# EasyEDA Pro project Ease buck regulator v2.eprj

# Schematic Schematic1
Board Name: Board1; Create Date: 2025-06-07; Page Name: P1; Project Name: Ease buck regulator v2; Schematic Name: Schematic1; Update Date: 2025-06-10; Company: EasyEDA.com; Page Size: A4; Version: V1.0
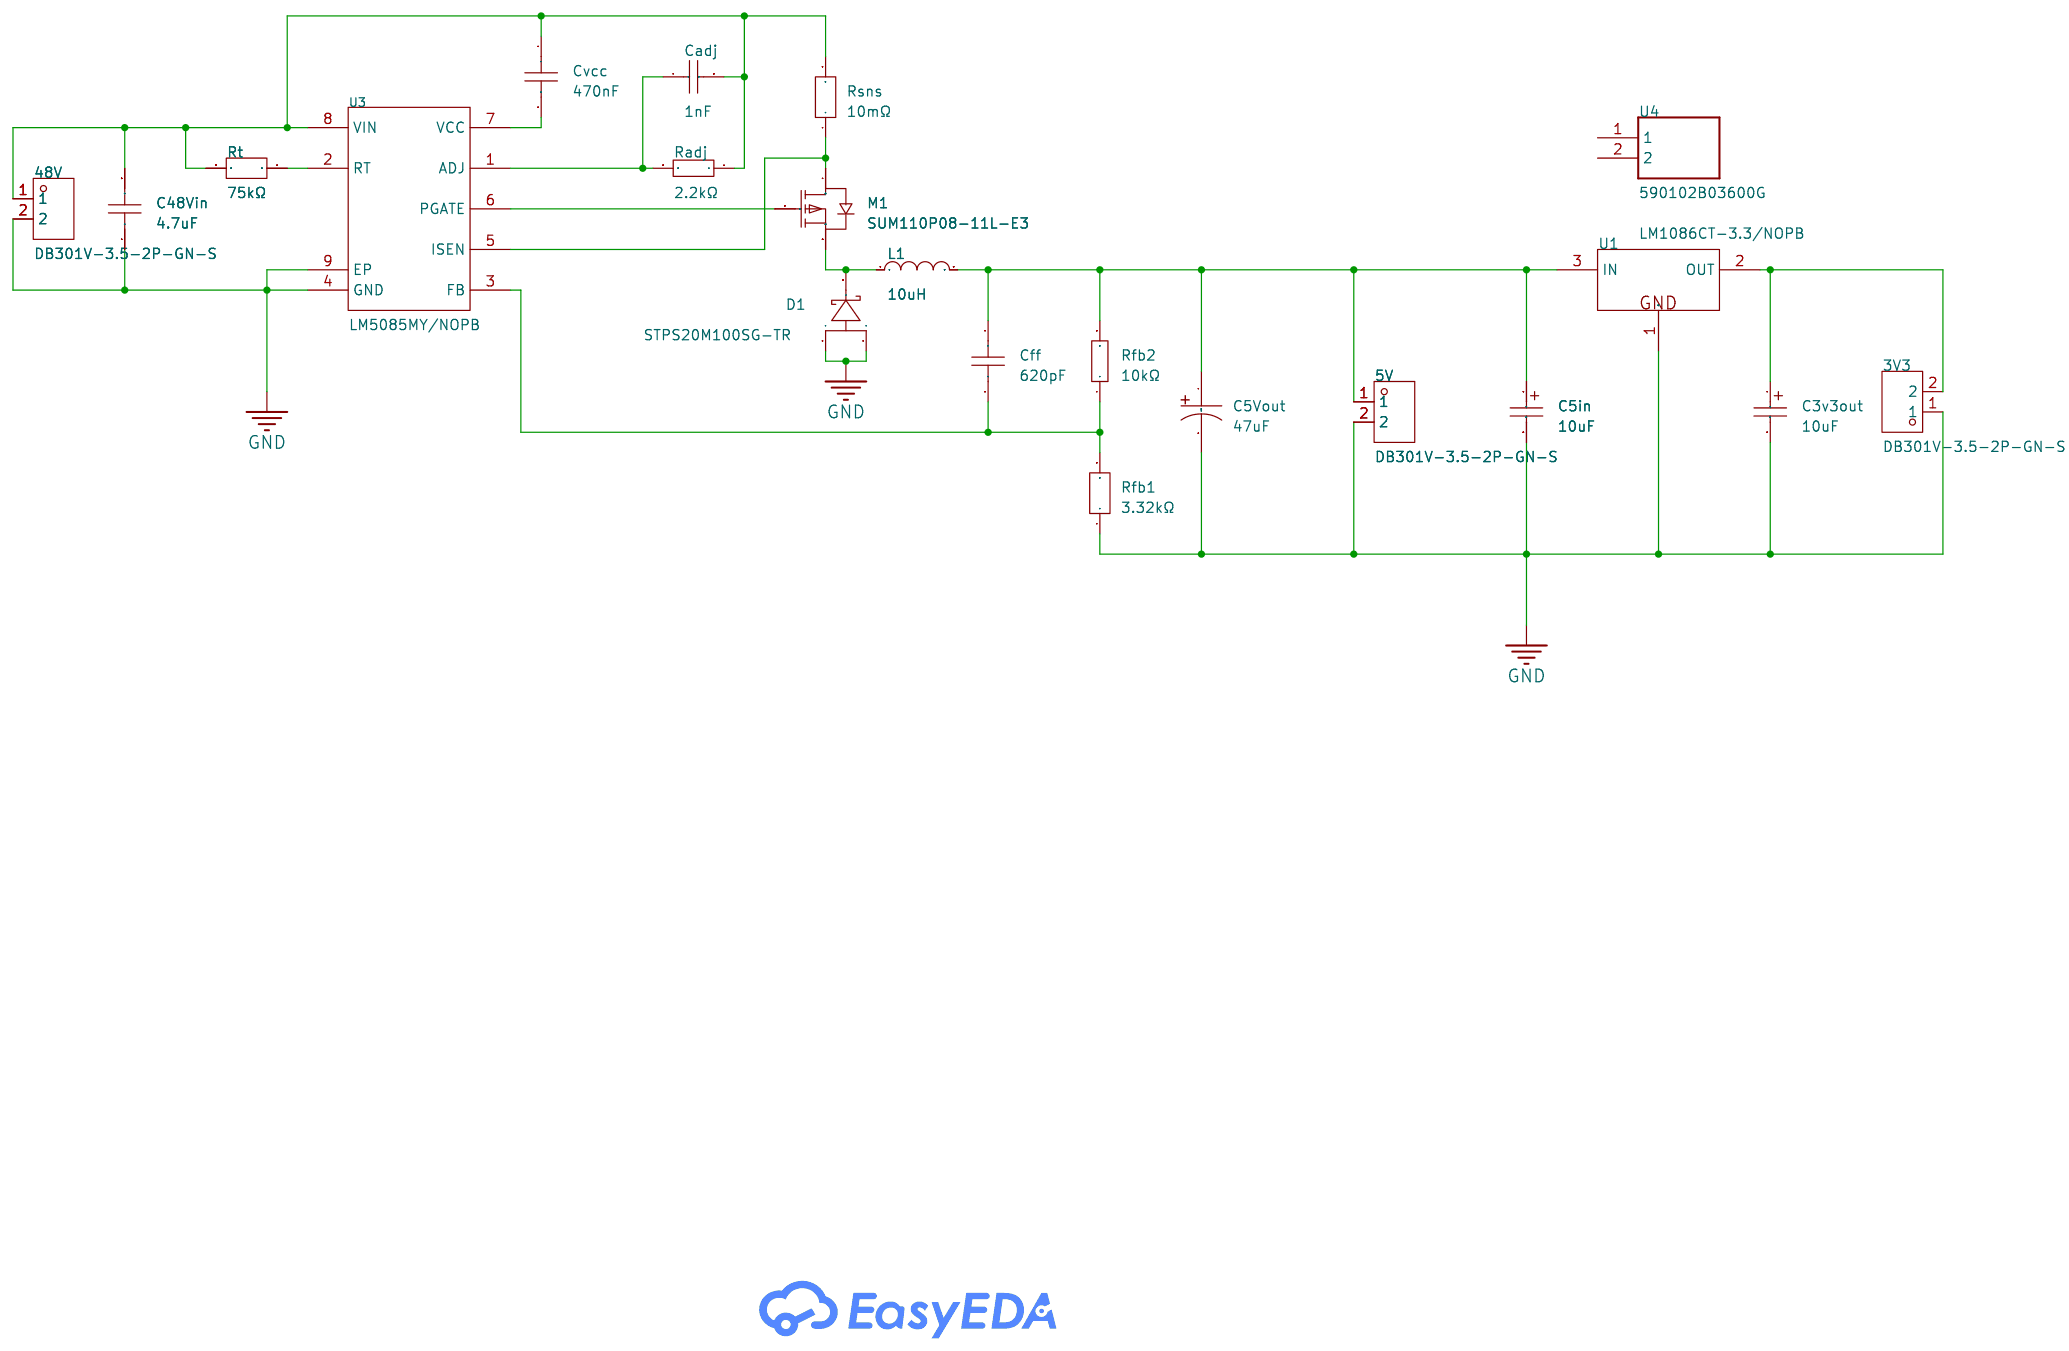
[diagram p0: schematic sheet]

## Parts
3V3  DB301V-3.5-2P-GN-S  [CONN-TH_DB301V-3.5-2P-GN]
5V  DB301V-3.5-2P-GN-S  [CONN-TH_DB301V-3.5-2P-GN]
48V  DB301V-3.5-2P-GN-S  [CONN-TH_DB301V-3.5-2P-GN]
C3v3out  10uF  [CASE-A_3216]
C5in  10uF  [CASE-A_3216]
C5Vout  47uF  [CAP-SMD_L3.5-W2.8]
C48Vin  4.7uF  [C1210]
Cadj  1nF  [C0805]
Cff  620pF  [C0805]
Cvcc  470nF  [C0805]
D1  STPS20M100SG-TR  [D2PAK_L10.4-W8.5-P2.54-LS15.4-BR]
L1  10uH  [IND-SMD_L13.9-W13.5]
M1  SUM110P08-11L-E3  [TO-263-2_L10.0-W9.1-P5.08-LS15.2-BL-2]
Radj  2.2kΩ  [R0603]
Rfb1  3.32kΩ  [R0402]
Rfb2  10kΩ  [R0402]
Rsns  10mΩ  [R1206]
Rt  75kΩ  [R0402]
U1  LM1086CT-3.3/NOPB  [TO-220-3_L10.0-W4.5-P2.54-L]
U3  LM5085MY/NOPB  [MSOP-8_L3.0-W3.0-P0.65-LS5.0-BL-EP]
U4  590102B03600G  [added line]

## Library data of the parts
3V3 5V 48V = DB301V-3.5-2P-GN-S: LCSC Part Name: 1x2P 3.5mm 直插 排数:1 每排P数:2; Supplier Part: C695629; Manufacturer: DORABO(地博电气); Supplier Footprint: 插件,P=3.5mm; JLCPCB Part Class: Extended Part; Datasheet: https://atta.szlcsc.com/upload/public/pdf/source/20230106/1B95616A85A883CA085E21635C8A8490.pdf; Supplier: LCSC; Number of Positions or Pins: 1x2P; Pitch: 3.5mm; Color: Green; Mounting Type: Direct Insert; Number of Pins: 2P; Number of Rows: 1; Number of PINs Per Row: 2; Screw Specification: M2; Current Rating: 7A; Voltage Rating (Max): 300V; Operating Temperature: -40℃~+105℃
C3v3out C5in = TAJA106M010RNJ: LCSC Part Name: 10uF ±20% 10V; Supplier Part: C92127; Manufacturer: Kyocera AVX; Supplier Footprint: CASE-A-3216; JLCPCB Part Class: Extended Part; Datasheet: https://atta.szlcsc.com/upload/public/pdf/source/20170322/1490151677352.pdf; Supplier: LCSC; Tolerance: ±20%; Equivalent Series Resistance(ESR): 3Ω@100kHz; Operating Temperature: -55℃~+125℃
C5Vout = TPSB476K010R0250: LCSC Part Name: 47uF ±10% 10V; Supplier Part: C308881; Manufacturer: Kyocera AVX; Supplier Footprint: CASE-B-3528; JLCPCB Part Class: Extended Part; Datasheet: https://atta.szlcsc.com/upload/public/pdf/source/20190621/C308909_9D37C5E2EC8949438110162F4533A132.pdf; Supplier: LCSC; Tolerance: ±10%; Equivalent Series Resistance(ESR): 250mΩ@100kHz; Operating Temperature: -55℃~+125℃
C48Vin = GCM32DC72A475KE02L: LCSC Part Name: 4.7uF ±10% 100V; Supplier Part: C913445; Manufacturer: muRata(村田); Supplier Footprint: 1210; JLCPCB Part Class: Extended Part; Datasheet: https://atta.szlcsc.com/upload/public/pdf/source/20201110/C913436_BC89257AF1CC170DEC759F9C1F15D7BC.pdf; Supplier: LCSC; Tolerance: ±10%; Voltage Rating: 100V; Temperature Coefficient: X7S
Cadj = CL21C102JBCNNNC: LCSC Part Name: 1nF ±5% 50V; Supplier Part: C1791; Manufacturer: SAMSUNG(三星); Supplier Footprint: 0805; JLCPCB Part Class: Extended Part; Datasheet: https://atta.szlcsc.com/upload/public/pdf/source/20160218/1457707763339.pdf; Supplier: LCSC; Tolerance: ±5%; Voltage Rating: 50V; Temperature Coefficient: C0G
Cff = CL21C621JBCNNNC: LCSC Part Name: 620pF ±5% 50V; Supplier Part: C307556; Manufacturer: SAMSUNG(三星); Supplier Footprint: 0805; JLCPCB Part Class: Extended Part; Datasheet: https://atta.szlcsc.com/upload/public/pdf/source/20160218/1457707763339.pdf; Supplier: LCSC; Tolerance: ±5%
Cvcc = TMK212BJ474KD-T: LCSC Part Name: MSAST219SB5474KTNA01 470nF ±10% 25V; Supplier Part: C386088; Manufacturer: TAIYO YUDEN(太诱); Supplier Footprint: 0805; JLCPCB Part Class: Extended Part; Datasheet: https://atta.szlcsc.com/upload/public/pdf/source/20210525/C2802164_C0429B055888A674C3F00BA74B841C5B.pdf; Supplier: LCSC; Tolerance: ±10%
D1 = STPS20M100SG-TR: LCSC Part Name: 电压:100V 电流:20A; Supplier Part: C969989; Manufacturer: ST(意法半导体); Supplier Footprint: D2PAK; JLCPCB Part Class: Extended Part; Datasheet: https://atta.szlcsc.com/upload/public/pdf/source/20201210/C969989_D9B9A94A3428CBD50DBC84FA20B76C6C.pdf; Supplier: LCSC; Diode Configuration: Independent Type; Forward Voltage (Vf@If): 775mV@20A; Reverse Voltage (Vr): 100V; Rectified Current: 20A; Reverse Leakage Current (Ir): 10uA@100V
L1 = SRP1250-100M: LCSC Part Name: 10uH ±20% 16A; Supplier Part: C2045749; Manufacturer: BOURNS; Supplier Footprint: SMD,13.5x13.9mm; JLCPCB Part Class: Extended Part; Datasheet: https://atta.szlcsc.com/upload/public/pdf/source/20210630/4DDA93E166372CA8826EA735E154300C.pdf; Supplier: LCSC; Tolerance: ±20%; Saturation Current (Isat): 16A
M1 = SUM110P08-11L-E3: LCSC Part Name: 1个P沟道 耐压:80V 电流:23.5A; Supplier Part: C2838509; Manufacturer: VISHAY(威世); Supplier Footprint: TO-263-2; JLCPCB Part Class: Extended Part; Datasheet: https://atta.szlcsc.com/upload/public/pdf/source/20210629/C2838509_ABAE0D27A8815A2567646410D30D40FD.pdf; Supplier: LCSC; Type: 1 Piece P-Channel; Drain Source On Resistance (RDS(on)@Vgs,Id): 0.0112Ω@10V,20A; Total Gate Charge (Qg@Vgs): 85nC@10V; Input Capacitance (Ciss@Vds): 10.85nF@40V; Reverse Transfer Capacitance (Crss@Vds): 700pF@40V; Operating Temperature: -55℃~+175℃
Radj = RC0603FR-072K2L: LCSC Part Name: 厚膜电阻 2.2kΩ ±1% 100mW; Supplier Part: C114662; Manufacturer: YAGEO(国巨); Supplier Footprint: 0603; JLCPCB Part Class: Extended Part; Datasheet: https://atta.szlcsc.com/upload/public/pdf/source/20170914/C127450_1505359406912967677.pdf; Supplier: LCSC; Type: Thick Film Resistors; Tolerance: ±1%; Power(Watts): 100mW; Voltage-Supply(Max): 75V; Temperature Coefficient: ±100ppm/℃; Operating Temperature: -55℃~+155℃
Rfb1 = CRCW04023K32FKED: LCSC Part Name: 厚膜电阻 3.32kΩ ±1% 62.5mW; Supplier Part: C4190093; Manufacturer: VISHAY(威世); Supplier Footprint: 0402; JLCPCB Part Class: Extended Part; Datasheet: https://atta.szlcsc.com/upload/public/pdf/source/20231211/912936F7C39622EC4E701DC64839DA0A.pdf; Supplier: LCSC; Type: Thick Film Resistors; Tolerance: ±1%; Power(Watts): 62.5mW; Temperature Coefficient: ±100ppm/℃; Operating Temperature: -55℃~+155℃
Rfb2 = CRCW040210K0FKED: LCSC Part Name: 厚膜电阻 10kΩ ±1% 63mW; Supplier Part: C71617; Manufacturer: VISHAY(威世); Supplier Footprint: 0402; JLCPCB Part Class: Extended Part; Datasheet: https://atta.szlcsc.com/upload/public/pdf/source/20180420/C190124_A776A444B598E5893D919B5902899056.pdf; Supplier: LCSC; Type: Thick Film Resistors; Tolerance: ±1%; Power(Watts): 63mW; Voltage-Supply(Max): 50V; Temperature Coefficient: ±100ppm/℃; Operating Temperature: -55℃~+155℃
Rsns = WSLP1206R0100FEA: LCSC Part Name: 10mΩ ±1% 1W; Supplier Part: C844910; Manufacturer: VISHAY(威世); Supplier Footprint: 1206; JLCPCB Part Class: Extended Part; Datasheet: https://atta.szlcsc.com/upload/public/pdf/source/20211116/D765CD6DEE6B58580DC3D6FFBE8A7951.pdf; Supplier: LCSC; Tolerance: ±1%; Power(Watts): 1W; Temperature Coefficient: ±75ppm/℃; Operating Temperature: -65℃~+170℃
Rt = CRCW040275K0FKED: LCSC Part Name: 厚膜电阻 75kΩ ±1% 63mW; Supplier Part: C482234; Manufacturer: VISHAY(威世); Supplier Footprint: 0402; JLCPCB Part Class: Extended Part; Datasheet: https://atta.szlcsc.com/upload/public/pdf/source/20200618/C481956_E25174B008CE8C884BEDD7D4D15E674F.pdf; Supplier: LCSC; Type: Thick Film Resistors; Tolerance: ±1%; Power(Watts): 63mW; Voltage-Supply(Max): 75V; Temperature Coefficient: ±100ppm/℃; Operating Temperature: -55℃~+155℃
U1 = LM1086CT-3.3/NOPB: LCSC Part Name: 1.5A、29V 线性稳压器; Supplier Part: C2877404; Manufacturer: TI(德州仪器); Supplier Footprint: TO-220; JLCPCB Part Class: Extended Part; Datasheet: https://www.ti.com/cn/lit/gpn/lm1086; Supplier: LCSC; Output Type: Fixed; Voltage - Supply: 27V; Output Voltage: 3.3V; Output Current: 1.5A; Power Supply Rejection Ratio (PSRR): 72dB@(120Hz); Voltage Dropout: 1.5V@(1.5A); standby current: 5mA; Features: Overcurrent Protection(OCP); Operating Temperature: 0℃~+125℃; Output Configuration: Positive electrode; Number of Outputs: 1
U3 = LM5085MY/NOPB: Supplier Part: C79823; Manufacturer: TI(德州仪器); Supplier Footprint: MSOP-8-EP; JLCPCB Part Class: Extended Part; Datasheet: https://www.ti.com/cn/lit/gpn/lm5085; Supplier: LCSC; Function: Step-down type; Input Voltage: 4.5V~75V; Switching Frequency: 1MHz; Operating Temperature: -40℃~+125℃@(TJ); Synchronous Rectification: NO; Number of Outputs: 1; Topology: Step-down; Switch tube (built-in/external): 外置
U4 = 590102B03600G: heatsink 10 C W

## Nets
GND: 3V3.1 5V.2 48V.2 C3v3out.2 C5in.2 C5Vout.2 C48Vin.1 D1.1(A) D1.2(A) Rfb1.1 U1.1(GND) U3.4(GND) U3.9(EP)
$1N4213: 48V.1 C48Vin.2 Cadj.2 Cvcc.1 Radj.1 Rsns.2 Rt.2 U3.8(VIN)
$1N4243: Rt.1 U3.2(RT)
$1N4505: Cvcc.2 U3.7(VCC)
$1N4530: Cadj.1 Radj.2 U3.1(ADJ)
$1N4608: M1.4(D) Rsns.1 U3.5(ISEN)
$1N4627: M1.1(G) U3.6(PGATE)
$1N4634: D1.3(K) L1.1 M1.3(S)
$1N4655: 5V.1 C5in.1 C5Vout.1 Cff.1 L1.2 Rfb2.2 U1.3(IN)
$1N4682: Cff.2 Rfb1.2 Rfb2.1 U3.3(FB)
$1N5055: 3V3.2 C3v3out.1 U1.2(OUT)

Not connected (* = marked no-connect by the designer): U4 1 2

# Board PCB1
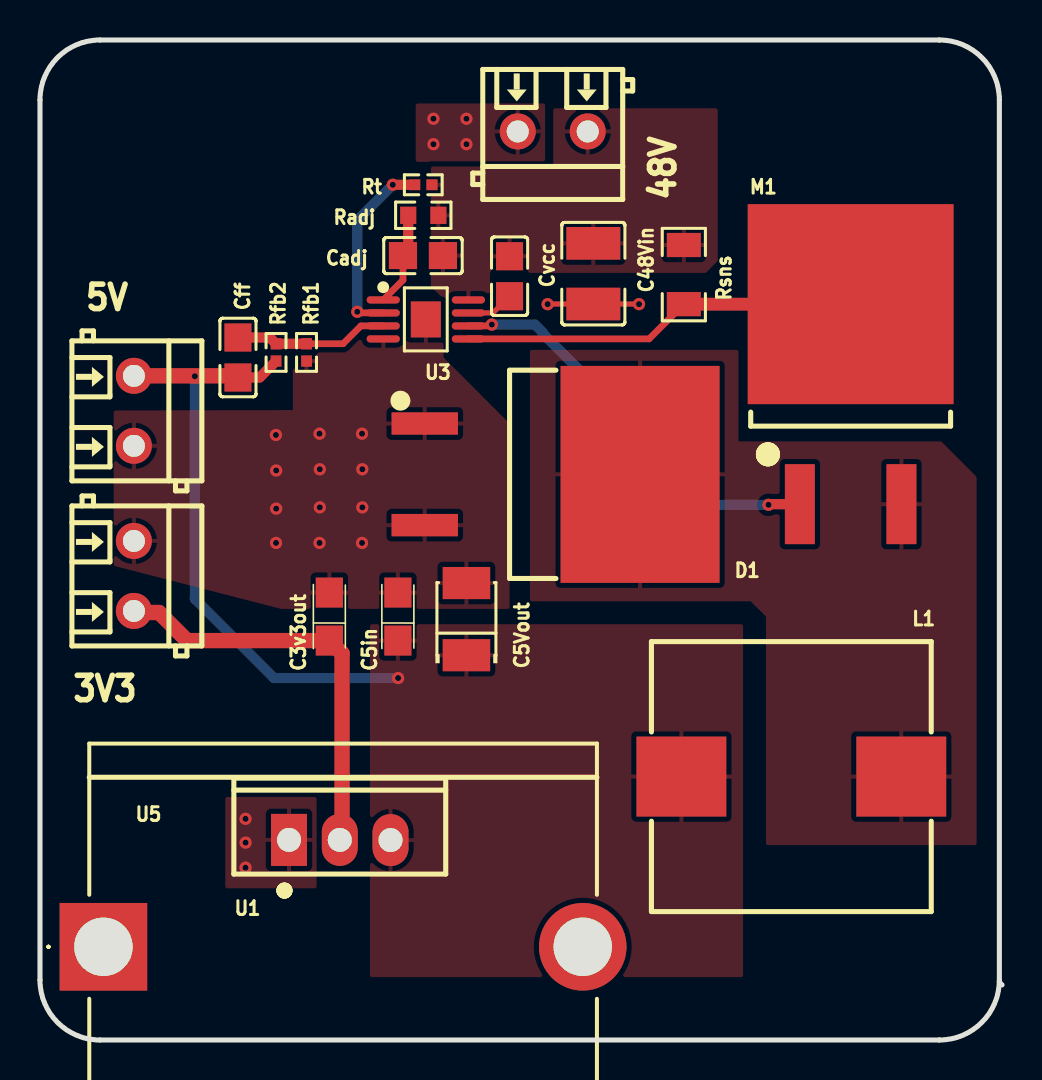
[diagram p1: board, top side]
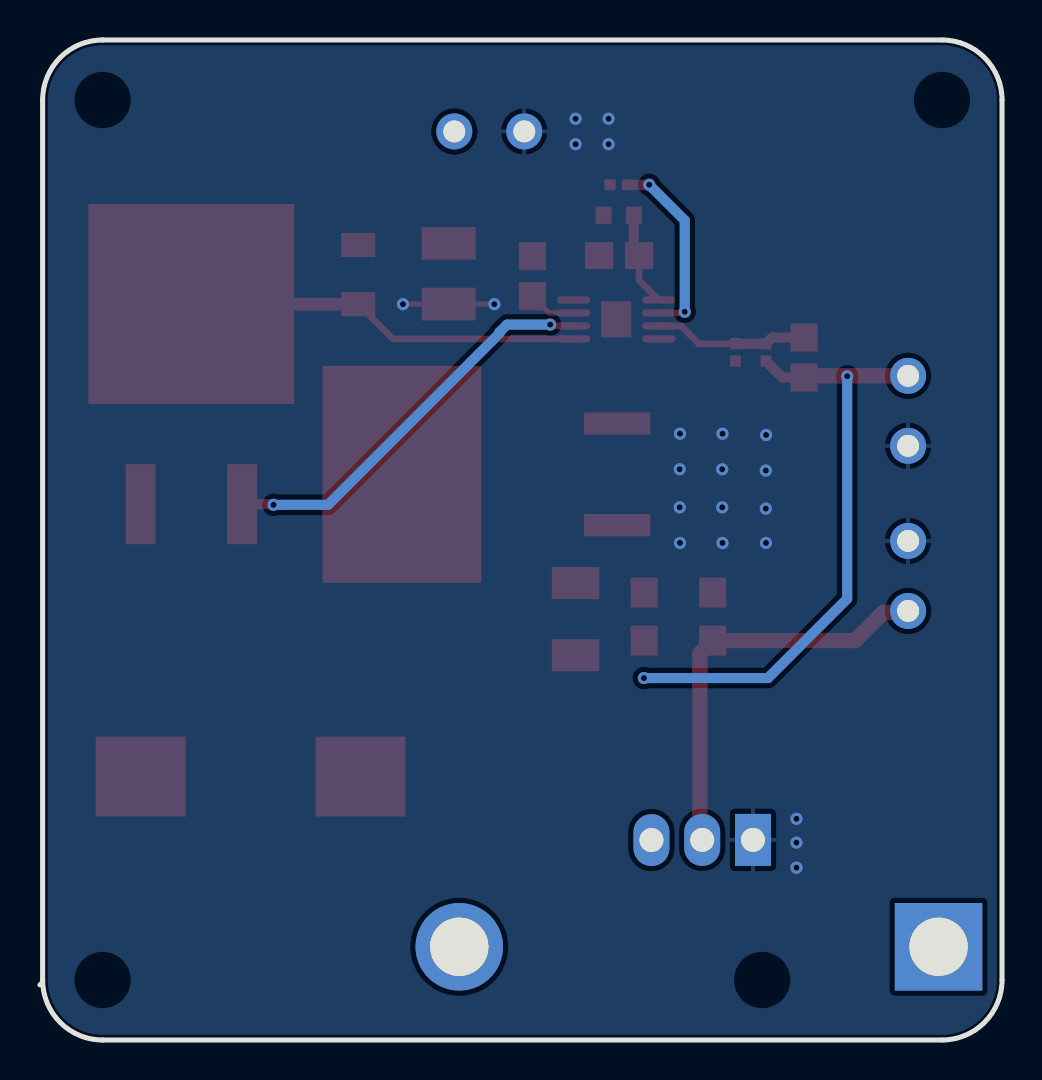
[diagram p2: board, bottom side, seen from below]

Outline 48.13 x 50 mm; copper layers: Top Layer, Bottom Layer. Coordinates in mm from the lower left corner of the outline.
Outline path: 48,3 arc(47.12,0.88) 45,0 3,0 arc(0.88,0.88) 0,3 0,47 arc(0.88,49.12) 3,50 45,50 arc(47.12,49.12) 48,47 48,2.89 48.13,2.76
Stack: Top Layer 0.035mm / Dielectric1 1.51mm FR4 er 4.5 / Bottom Layer 0.035mm

## Design rules (mm)
template: Custom Config
spacing copperThickness1oz (default): track to track 0.152, other pairs 0.152 to 0.3
spacing copperThickness2oz: track to track 0.203, other pairs 0.152 to 0.3
track width copperThickness1oz (default): min 0.127, default 0.254, max 2.54
track width copperThickness2oz: min 0.203, default 0.254, max 2.54
differential pair differentialPair (default): width min 0.127, default 0.254, max 2.54; gap min 0.152, default 0.152
via viaSize (default): diameter min 0.5, default 0.61, max 10; hole min 0.3, default 0.305, max 6.3

## Placement (name value [footprint] x y rotation side)
3V3  DB301V-3.5-2P-GN-S  [CONN-TH_DB301V-3.5-2P-GN]  4.7 23.2 270 top
5V  DB301V-3.5-2P-GN-S  [CONN-TH_DB301V-3.5-2P-GN]  4.7 31.46 270 top
48V  DB301V-3.5-2P-GN-S  [CONN-TH_DB301V-3.5-2P-GN]  25.65 45.43 180 top
C3v3out  10uF  [CASE-A_3216]  14.48 21.17 90 top
C5in  10uF  [CASE-A_3216]  17.91 21.17 90 top
C5Vout  47uF  [CAP-SMD_L3.5-W2.8]  21.34 21.04 270 top
C48Vin  4.7uF  [C1210]  27.69 38.32 90 top
Cadj  1nF  [C0805]  19.16 39.22 0 top
Cff  620pF  [C0805]  9.91 34.12 90 top
Cvcc  470nF  [C0805]  23.5 38.19 270 top
D1  STPS20M100SG-TR  [D2PAK_L10.4-W8.5-P2.54-LS15.4-BR]  24.64 28.28 0 top
L1  10uH  [IND-SMD_L13.9-W13.5]  37.59 13.17 180 top
M1  SUM110P08-11L-E3  [TO-263-2_L10.0-W9.1-P5.08-LS15.2-BL-2]  40.56 31.79 0 top
Radj  2.2kΩ  [R0603]  19.18 41.24 180 top
Rfb1  3.32kΩ  [R0402]  13.34 34.38 90 top
Rfb2  10kΩ  [R0402]  11.81 34.38 270 top
Rsns  10mΩ  [R1206]  32.21 38.27 90 top
Rt  75kΩ  [R0402]  19.18 42.76 0 top
U1  LM1086CT-3.3/NOPB  [TO-220-3_L10.0-W4.5-P2.54-L]  15 10 0 top
U3  LM5085MY/NOPB  [MSOP-8_L3.0-W3.0-P0.65-LS5.0-BL-EP]  19.3 36.03 270 top
U5  590102B03600G  [added line]  15.11 15.84 0 top

## Footprints (pads in the part's own frame, mm; a bottom-side part is the same pattern mirrored in y, then rotated)
added line
  rect 4.38x4.38 hole 2.92: 1(-11.938,-11.176)
  round 4.38 hole 2.92: 2(12.042,-11.176)
C0805
  rect 1.41x1.35 smd: 1(-1,0) 2(1,0)
C1210
  rect 1.635x2.7 smd: 1(-1.518,0) 2(1.518,0)
CAP-SMD_L3.5-W2.8
  rect 1.607x2.376 smd: 1(1.804,0) 2(-1.804,0)
CASE-A_3216
  rect 1.5x1.359 smd: 1(-1.2,0) 2(1.2,0)
CONN-TH_DB301V-3.5-2P-GN
  round 1.8 hole 1.1: 1(-1.75,0) 2(1.75,0)
D2PAK_L10.4-W8.5-P2.54-LS15.4-BR
  rect 3.318x1.12 smd: 1(-5.386,2.54) 2(-5.386,-2.54)
  rect 7.954x10.842 smd: 3(5.386,0)
IND-SMD_L13.9-W13.5
  rect 4.5x4 smd: 1(-5.5,0) 2(5.5,0)
MSOP-8_L3.0-W3.0-P0.65-LS5.0-BL-EP
  oval 0.364x1.662 smd: 1(-0.975,-2.131) 2(-0.325,-2.131) 3(0.325,-2.131) 4(0.975,-2.131) 5(0.975,2.131) 6(0.325,2.131) 7(-0.325,2.131) 8(-0.975,2.131)
  rect 1.8x1.5 smd: 9(0,0)
R0402
  rect 0.566x0.54 smd: 1(-0.433,0) 2(0.433,0)
R0603
  rect 0.806x0.864 smd: 1(-0.753,0) 2(0.753,0)
R1206
  rect 1.208x1.701 smd: 1(-1.479,0) 2(1.479,0)
TO-220-3_L10.0-W4.5-P2.54-L
  rect 1.8x2.6 hole 1.2: 1(-2.54,0.005)
  oval 1.8x2.6 hole 1.2: 2(0,0.005) 3(2.54,-0.005)
TO-263-2_L10.0-W9.1-P5.08-LS15.2-BL-2
  rect 1.5x4 smd: 1(-2.54,-5) 3(2.54,-5)
  rect 10.3x10 smd: 4(0.001,5)

## Nets
As in the schematic.

Pads without a net: U5 1 2

## Via types
v1: diameter 0.61, hole 0.305, Top Layer to Bottom Layer, 27 vias

## Routing (per net, layer and track width the routed paths; a pad name or vN(x,y) marks a point on that pad's centre or on a via; arc(x,y) is an arc through that point)
GND: length 4.6
  Top Layer w0.254: v1(25.4,36.79) 25.41,36.8 C48Vin.1 29.97,36.8 v1(29.97,36.79)
  vias: v1(10.28,11.06) v1(10.29,9.87) v1(10.28,8.62) v1(11.8,30.25) v1(11.82,28.47) v1(11.82,26.57) v1(11.81,24.85) v1(13.99,30.31) v1(14,28.54) v1(14,26.63) v1(13.99,24.85) v1(16.11,30.31) v1(16.13,28.54) v1(16.13,26.63) v1(16.11,24.85) v1(19.69,46.06) v1(19.69,44.79) v1(21.34,46.06) v1(21.34,44.79)
$1N4243: length 9.5
  Top Layer w0.33: U3.2 15.93,36.36 v1(15.88,36.41)
  Top Layer w0.508: Rt.1 v1(17.65,42.76)
  Bottom Layer w0.508: v1(15.88,36.41) 15.88,40.98 v1(17.65,42.76)
$1N4505: length 2.4
  Top Layer w0.254: Cvcc.2 22.66,36.36 U3.7
$1N4530: length 4.7
  Top Layer w0.33: Cadj.1 18.16,37.99 U3.1
  Top Layer w0.508: Radj.2 18.42,39.48 Cadj.1
$1N4608: length 19.7
  Top Layer w0.33: Rsns.1 30.48,35.06 U3.5
  Top Layer w0.635: Rsns.1 40.43,36.79
$1N4627: length 20.3
  Top Layer w0.33: v1(22.61,35.77) 22.54,35.7 U3.6
  Top Layer w0.508: M1.1 36.58,26.79
  Bottom Layer w0.508: v1(36.45,26.76) 33.72,26.76 25.15,35.33 25.15,35.39 24.76,35.77 v1(22.61,35.77)
$1N4655: length 30.4
  Top Layer w0.508: Cff.1 10.99,33.12 Rfb2.2
  Top Layer w0.762: 5V.1 9.82,33.21 Cff.1
  Bottom Layer w0.508: v1(7.75,33.19) 7.75,22.06 11.71,18.1 v1(17.92,18.1)
$1N4682: length 7.8
  Top Layer w0.33: U3.3 16.06,35.7 15.16,34.81 Rfb1.2
  Top Layer w0.508: Cff.2 11.5,35.12 Rfb2.1 Rfb1.2
$1N5055: length 19.5
  Top Layer w0.762: 15.11,11.14 15.11,19.34 C3v3out.1 7.36,19.97 5.95,21.38 4.78,21.38 3V3.2

## Copper pours and planes (outline as drawn; the poured copper is in the pictures)
GND on Top Layer: 18.8,46.83 25.27,46.83 25.27,43.9 18.8,43.9
GND on Top Layer: 3.68,23.71 12.06,21.55 23.5,21.55 23.5,30.82 20.19,34.12 20.19,37.05 18.29,37.05 18.29,35.44 18.23,35.39 16.26,35.39 15.25,34.38 12.66,34.38 12.66,31.5 3.7,31.48 3.69,31.46 3.69,23.71
GND on Top Layer: 9.27,12.15 13.84,12.15 13.84,7.58 9.27,7.58
GND on Bottom Layer: -0.13,50.13 50.04,50.13 50.04,-2.2 -0.13,-2.2
$1N4213 on Top Layer: 25.67,46.59 25.67,43.68 19.56,43.68 19.56,37.68 20.57,36.67 22.52,36.67 22.52,38.35 33.31,38.35 33.91,38.95 33.91,46.59
$1N4634 on Top Layer: 24.51,34.51 24.51,21.93 35.56,21.93 36.32,21.17 36.32,9.74 46.86,9.74 46.86,28.16 45.09,29.93 34.95,29.93 34.95,34.51
$1N4655 on Top Layer: 16.51,20.79 16.51,3.15 35.18,3.15 35.18,20.79
